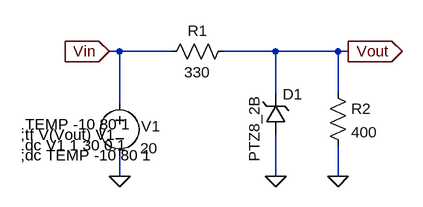
[diagram p0: schematic Zener.asc]
Zener.asc, the LTspice schematic file:
Version 4
SHEET 1 908 680
WIRE 48 32 32 32
WIRE 128 32 48 32
WIRE 288 32 208 32
WIRE 384 32 288 32
WIRE 400 32 384 32
WIRE 288 96 288 32
WIRE 384 96 384 32
WIRE 48 112 48 32
WIRE 48 224 48 192
WIRE 288 224 288 160
WIRE 384 224 384 176
FLAG 48 224 0
FLAG 384 224 0
FLAG 288 224 0
FLAG 400 32 Vout
IOPIN 400 32 Out
FLAG 32 32 Vin
IOPIN 32 32 In
SYMBOL voltage 48 96 R0
WINDOW 3 32 85 Left 2
WINDOW 123 0 0 Left 2
WINDOW 39 0 0 Left 2
WINDOW 0 33 51 Left 2
SYMATTR Value 20
SYMATTR InstName V1
SYMBOL res 224 16 R90
WINDOW 0 0 56 VBottom 2
WINDOW 3 32 56 VTop 2
SYMATTR InstName R1
SYMATTR Value 330
SYMBOL res 368 80 R0
SYMATTR InstName R2
SYMATTR Value 400
SYMBOL zener 272 160 M180
WINDOW 0 27 62 Left 2
WINDOW 3 -17 60 VLeft 2
SYMATTR InstName D1
SYMATTR Value PTZ8_2B
SYMATTR Description Diode
SYMATTR Type diode
TEXT -104 176 Left 2 !.dc V1 1 30 0.1
TEXT -104 160 Left 2 !;tf V(Vout) V1
TEXT -104 192 Left 2 !;dc TEMP -10 80 1
TEXT -104 144 Left 2 !.TEMP -10 80 1

The netlist it stands for:
* Zener.asc
V1 Vin 0 20
R1 Vout Vin 330
R2 Vout 0 400
D1 0 Vout PTZ8_2B
.model D D
.lib standard.dio
.dc V1 1 30 0.1
;tf V(Vout) V1
;dc TEMP -10 80 1
.TEMP -10 80 1
.backanno
.end